# Altium project Power_Box_V1.PrjPcb
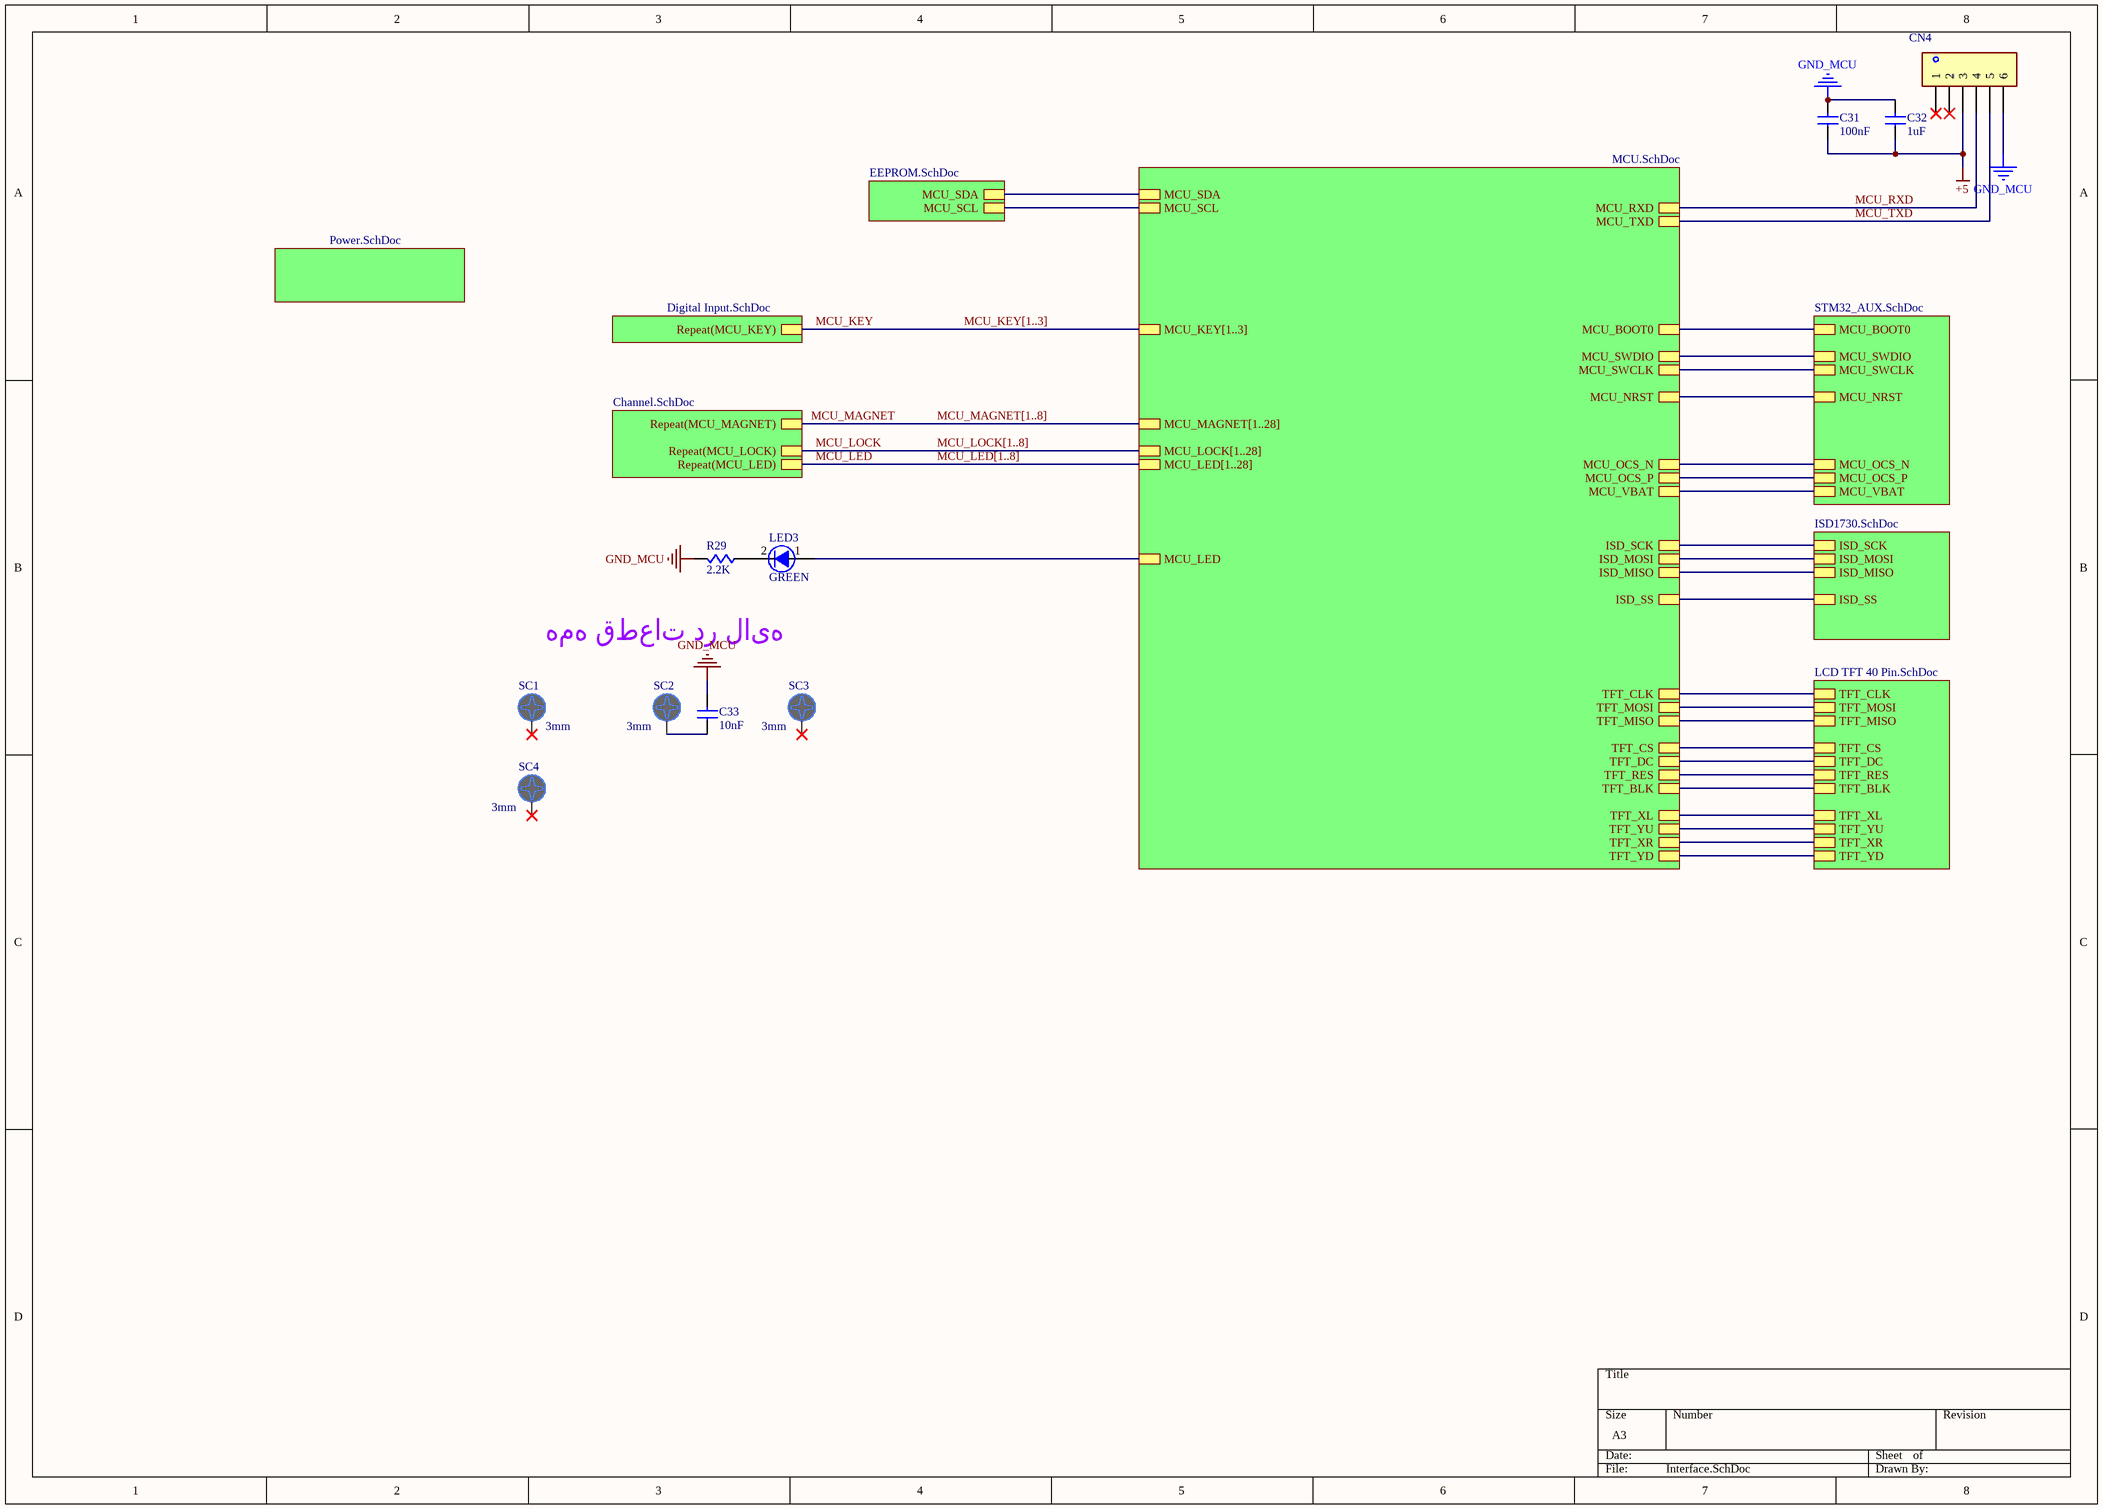
[diagram p0: Interface.SchDoc]
9 sheets, 207 parts. Net scope: hierarchical (ports join the sheet entries above them; power ports are global).
Board file: Power_Box_V1.PcbDoc
Sheets:
  Interface.SchDoc
    MCU = MCU.SchDoc
    STM_AUX = STM32_AUX.SchDoc
    TFT = LCD TFT 40 Pin.SchDoc
    ISD1730 = ISD1730.SchDoc
    EEPROM = EEPROM.SchDoc
    KEY1 = Digital Input.SchDoc
    KEY2 = Digital Input.SchDoc
    KEY3 = Digital Input.SchDoc
    Power = Power.SchDoc
    CHANNEL1 = Channel.SchDoc
    CHANNEL2 = Channel.SchDoc
    CHANNEL3 = Channel.SchDoc
    CHANNEL4 = Channel.SchDoc
    CHANNEL5 = Channel.SchDoc
    CHANNEL6 = Channel.SchDoc
    CHANNEL7 = Channel.SchDoc
    CHANNEL8 = Channel.SchDoc

## Sheet Interface.SchDoc
size A3; SheetNumber: 1; SheetTotal: 9

### Parts
C31  value 100nF  [C-0805]  (hidden comment: CAP Cer 100nF-50V-X7R-SMD)
C32  value 1uF  [C-0805]  (hidden comment: CAP Cer 1uF-50V-X7R-SMD)
C33  value 10nF  [CAP-CER-7x2.5-Ls5]  (hidden comment: CAP Cer 10nF-1KV-X7R-THD)
CN4  Connector XH-Straight-THD-2.54mm  [XH-6]  (value not drawn)
LED3  Color: GREEN  [LED-1206-Y]  (hidden comment: LED GREEN-1206-SMD)
R29  value 2.2K  [R-0805]  (hidden comment: RES 2.2K-5%-1/8W-SMD)
SC1  Size: 3mm  [Screw_M3]  (hidden comment: Screw 3mm)
SC2  Size: 3mm  [Screw_M3]  (hidden comment: Screw 3mm)
SC3  Size: 3mm  [Screw_M3]  (hidden comment: Screw 3mm)
SC4  Size: 3mm  [Screw_M3]  (hidden comment: Screw 3mm)

### Sub-sheets
EEPROM = EEPROM.SchDoc: MCU_SDA, MCU_SCL
ISD1730 = ISD1730.SchDoc: ISD_SCK, ISD_MOSI, ISD_MISO, ISD_SS
MCU = MCU.SchDoc: MCU_BOOT0, MCU_SWCLK, MCU_SWDIO, MCU_NRST, MCU_OCS_N, MCU_OCS_P, TFT_CS, TFT_CLK, TFT_DC, TFT_MOSI, TFT_MISO, TFT_RES, TFT_BLK, ISD_SCK, ISD_MOSI, ISD_MISO, ISD_SS, MCU_SDA, MCU_SCL, MCU_KEY[1..3], MCU_LOCK[1..28], MCU_LED[1..28], MCU_MAGNET[1..28], MCU_TXD, MCU_RXD, MCU_VBAT, TFT_XL, TFT_YU, TFT_XR, TFT_YD, MCU_LED
Power = Power.SchDoc: no entries
Repeat(CHANNEL, 1, 8) = Channel.SchDoc: Repeat(MCU_LOCK), Repeat(MCU_LED), Repeat(MCU_MAGNET)
Repeat(KEY, 1, 3) = Digital Input.SchDoc: Repeat(MCU_KEY)
STM_AUX = STM32_AUX.SchDoc: MCU_BOOT0, MCU_SWCLK, MCU_SWDIO, MCU_NRST, MCU_OCS_N, MCU_OCS_P, MCU_VBAT
TFT = LCD TFT 40 Pin.SchDoc: TFT_CS, TFT_CLK, TFT_DC, TFT_MOSI, TFT_MISO, TFT_RES, TFT_BLK, TFT_XL, TFT_YU, TFT_XR, TFT_YD

### Nets
+5: C31.1 C32.1 CN4.3
GND_MCU: C31.2 C32.2 C33.2 CN4.6 R29.2
ISD_MISO: sheet MCU/ISD_MISO, sheet ISD1730/ISD_MISO
ISD_MOSI: sheet MCU/ISD_MOSI, sheet ISD1730/ISD_MOSI
ISD_SCK: sheet MCU/ISD_SCK, sheet ISD1730/ISD_SCK
ISD_SS: sheet MCU/ISD_SS, sheet ISD1730/ISD_SS
MCU_BOOT0: sheet MCU/MCU_BOOT0, sheet STM_AUX/MCU_BOOT0
MCU_KEY: sheet Repeat(KEY, 1, 3)/Repeat(MCU_KEY)  [also labelled MCU_KEY[1..3]]
MCU_LED: sheet Repeat(CHANNEL, 1, 8)/Repeat(MCU_LED)
MCU_LOCK: sheet Repeat(CHANNEL, 1, 8)/Repeat(MCU_LOCK)
MCU_MAGNET: sheet Repeat(CHANNEL, 1, 8)/Repeat(MCU_MAGNET)
MCU_NRST: sheet MCU/MCU_NRST, sheet STM_AUX/MCU_NRST
MCU_OCS_N: sheet MCU/MCU_OCS_N, sheet STM_AUX/MCU_OCS_N
MCU_OCS_P: sheet MCU/MCU_OCS_P, sheet STM_AUX/MCU_OCS_P
MCU_RXD: CN4.4 ; sheet MCU/MCU_RXD
MCU_SCL: sheet MCU/MCU_SCL, sheet EEPROM/MCU_SCL
MCU_SDA: sheet MCU/MCU_SDA, sheet EEPROM/MCU_SDA
MCU_SWCLK: sheet MCU/MCU_SWCLK, sheet STM_AUX/MCU_SWCLK
MCU_SWDIO: sheet MCU/MCU_SWDIO, sheet STM_AUX/MCU_SWDIO
MCU_TXD: CN4.5 ; sheet MCU/MCU_TXD
MCU_VBAT: sheet MCU/MCU_VBAT, sheet STM_AUX/MCU_VBAT
TFT_BLK: sheet MCU/TFT_BLK, sheet TFT/TFT_BLK
TFT_CLK: sheet MCU/TFT_CLK, sheet TFT/TFT_CLK
TFT_CS: sheet MCU/TFT_CS, sheet TFT/TFT_CS
TFT_DC: sheet MCU/TFT_DC, sheet TFT/TFT_DC
TFT_MISO: sheet MCU/TFT_MISO, sheet TFT/TFT_MISO
TFT_MOSI: sheet MCU/TFT_MOSI, sheet TFT/TFT_MOSI
TFT_RES: sheet MCU/TFT_RES, sheet TFT/TFT_RES
TFT_XL: sheet MCU/TFT_XL, sheet TFT/TFT_XL
TFT_XR: sheet MCU/TFT_XR, sheet TFT/TFT_XR
TFT_YD: sheet MCU/TFT_YD, sheet TFT/TFT_YD
TFT_YU: sheet MCU/TFT_YU, sheet TFT/TFT_YU
NetC33_1: C33.1 SC2.1
NetLED3_1: LED3.1(A) ; sheet MCU/MCU_LED
NetLED3_2: LED3.2(C) R29.1

Not connected (* = marked no-connect by the designer): CN4 1* 2*; SC1 1*; SC3 1*; SC4 1*

### Buses and harness runs
bus MCU_LED[1..8] = sheet MCU/MCU_LED[1..28]
bus MCU_LOCK[1..8] = sheet MCU/MCU_LOCK[1..28]
bus MCU_MAGNET[1..8] = sheet MCU/MCU_MAGNET[1..28]

### Notes on the sheet
- همه قطعات در لایه بالا قرار بگیرند

### Library data of the parts
C31 C32 = CAP-CER: CAPACITOR; Phone Number: 0915 8700 314; Voltage: 50V; Tolerance: X7R; Type: SMD; Publisher: Mahdi Bagherzadeh; ComponentLink1Description: Linkedin; ComponentLink1URL: https://ir.linkedin.com/in/mahdi-bagherzade; Published Date: 9-15-2024
C33 = CAP-CER: CAPACITOR; Phone Number: 0915 8700 314; Voltage: 1KV; Tolerance: X7R; Type: THD; Publisher: Mahdi Bagherzadeh; ComponentLink1Description: Linkedin; ComponentLink1URL: https://ir.linkedin.com/in/mahdi-bagherzade; Published Date: 9-15-2024
CN4 = CN-6pin: CONNECTOR; Phone Number: 0915 8700 314; Value: XH; Publisher: Mahdi Bagherzadeh; ComponentLink1Description: Linkedin; ComponentLink1URL: https://ir.linkedin.com/in/mahdi-bagherzade; Published Date: 9-15-2024; Size: 2.54mm; Type: Straight-THD
LED3 = LED: Phone Number: 0915 8700 314; Type: SMD; Publisher: Mahdi Bagherzadeh; ComponentLink1Description: Linkedin; ComponentLink1URL: https://ir.linkedin.com/in/mahdi-bagherzade; Published Date: 9-15-2024; Size: 1206
R29 = RES: RESISTOR; Phone Number: 0915 8700 314; Tolerance: 5%; Power: 1/8W; Publisher: Mahdi Bagherzadeh; ComponentLink1Description: Linkedin; ComponentLink1URL: https://ir.linkedin.com/in/mahdi-bagherzade; Published Date: 9-15-2024; Type: SMD
SC1-SC4 = SCREW: Phone Number: 0915 8700 314; Publisher: Mahdi Bagherzadeh; ComponentLink1Description: Linkedin; ComponentLink1URL: https://ir.linkedin.com/in/mahdi-bagherzade; Published Date: 9-15-2024

## Sheet MCU.SchDoc
size A4; SheetNumber: 7; SheetTotal: 9
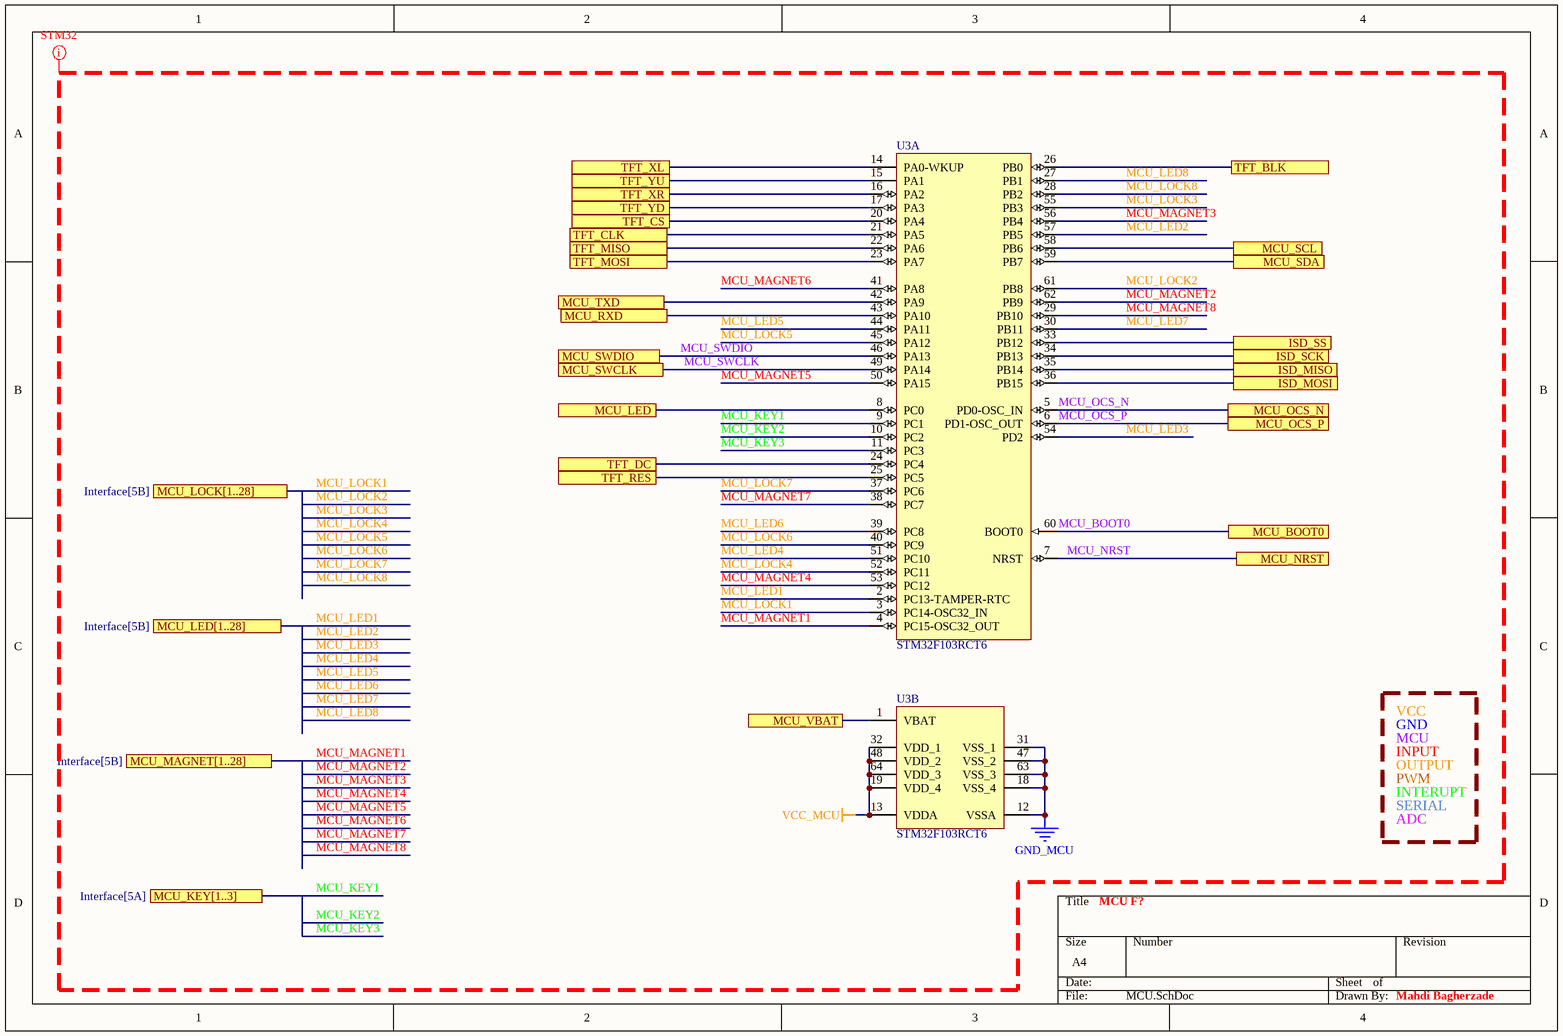
[diagram p1: MCU.SchDoc]

### Parts
U3  STM32F103RCT6  [STM-LQFP64_N]  (parts A,B of 2)

### Ports
ISD_MISO (see Interface[7B], ISD1730[1B]), ISD_MOSI (see Interface[7B], ISD1730[1B]), ISD_SCK (see Interface[7B], ISD1730[1B]), ISD_SS (see Interface[7B], ISD1730[1B]), MCU_BOOT0 (see Interface[7A], STM32_AUX[2B]), MCU_KEY[1..3] (see Interface[5A]), MCU_LED (see Interface[5B]), MCU_LED[1..28] (see Interface[5B]), MCU_LOCK[1..28] (see Interface[5B]), MCU_MAGNET[1..28] (see Interface[5B]), MCU_NRST (see Interface[7B], STM32_AUX[3A]), MCU_OCS_N (see Interface[7B], STM32_AUX[4A]), MCU_OCS_P (see Interface[7B], STM32_AUX[4A]), MCU_RXD (see Interface[7A]), MCU_SCL (see Interface[5A], EEPROM[3B]), MCU_SDA (see Interface[5A], EEPROM[3B]), MCU_SWCLK (see Interface[7A], STM32_AUX[2B]), MCU_SWDIO (see Interface[7A], STM32_AUX[2B]), MCU_TXD (see Interface[7A]), MCU_VBAT (see Interface[7B], STM32_AUX[1D]), TFT_BLK (see Interface[7C], LCD TFT 40 Pin[1B]), TFT_CLK (see Interface[7B], LCD TFT 40 Pin[1A]), TFT_CS (see Interface[7B], LCD TFT 40 Pin[1A]), TFT_DC (see Interface[7C], LCD TFT 40 Pin[1A]), TFT_MISO (see Interface[7B], LCD TFT 40 Pin[1A]), TFT_MOSI (see Interface[7B], LCD TFT 40 Pin[1A]), TFT_RES (see Interface[7C], LCD TFT 40 Pin[1B]), TFT_XL (see Interface[7C], LCD TFT 40 Pin[1B]), TFT_XR (see Interface[7C], LCD TFT 40 Pin[1B]), TFT_YD (see Interface[7C], LCD TFT 40 Pin[1B]), TFT_YU (see Interface[7C], LCD TFT 40 Pin[1B])

### Nets
GND_MCU: U3.12(VSSA) U3.18(VSS_4) U3.31(VSS_1) U3.47(VSS_2) U3.63(VSS_3)
VCC_MCU: U3.13(VDDA) U3.19(VDD_4) U3.32(VDD_1) U3.48(VDD_2) U3.64(VDD_3)
ISD_MISO: U3.35(PB14) ; port ISD_MISO
ISD_MOSI: U3.36(PB15) ; port ISD_MOSI
ISD_SCK: U3.34(PB13) ; port ISD_SCK
ISD_SS: U3.33(PB12) ; port ISD_SS
MCU_BOOT0: U3.60(BOOT0) ; port MCU_BOOT0
MCU_KEY1: U3.9(PC1)
MCU_KEY2: U3.10(PC2)
MCU_KEY3: U3.11(PC3)
MCU_LED1: U3.2(PC13-TAMPER-RTC)
MCU_LED2: U3.57(PB5)
MCU_LED3: U3.54(PD2)
MCU_LED4: U3.51(PC10)
MCU_LED5: U3.44(PA11)
MCU_LED6: U3.39(PC8)
MCU_LED7: U3.30(PB11)
MCU_LED8: U3.27(PB1)
MCU_LOCK1: U3.3(PC14-OSC32_IN)
MCU_LOCK2: U3.61(PB8)
MCU_LOCK3: U3.55(PB3)
MCU_LOCK4: U3.52(PC11)
MCU_LOCK5: U3.45(PA12)
MCU_LOCK6: U3.40(PC9)
MCU_LOCK7: U3.37(PC6)
MCU_LOCK8: U3.28(PB2)
MCU_MAGNET1: U3.4(PC15-OSC32_OUT)
MCU_MAGNET2: U3.62(PB9)
MCU_MAGNET3: U3.56(PB4)
MCU_MAGNET4: U3.53(PC12)
MCU_MAGNET5: U3.50(PA15)
MCU_MAGNET6: U3.41(PA8)
MCU_MAGNET7: U3.38(PC7)
MCU_MAGNET8: U3.29(PB10)
MCU_NRST: U3.7(NRST) ; port MCU_NRST
MCU_OCS_N: U3.5(PD0-OSC_IN) ; port MCU_OCS_N
MCU_OCS_P: U3.6(PD1-OSC_OUT) ; port MCU_OCS_P
MCU_RXD: U3.43(PA10) ; port MCU_RXD
MCU_SCL: U3.58(PB6) ; port MCU_SCL
MCU_SDA: U3.59(PB7) ; port MCU_SDA
MCU_SWCLK: U3.49(PA14) ; port MCU_SWCLK
MCU_SWDIO: U3.46(PA13) ; port MCU_SWDIO
MCU_TXD: U3.42(PA9) ; port MCU_TXD
MCU_VBAT: U3.1(VBAT) ; port MCU_VBAT
TFT_BLK: U3.26(PB0) ; port TFT_BLK
TFT_CLK: U3.21(PA5) ; port TFT_CLK
TFT_CS: U3.20(PA4) ; port TFT_CS
TFT_DC: U3.24(PC4) ; port TFT_DC
TFT_MISO: U3.22(PA6) ; port TFT_MISO
TFT_MOSI: U3.23(PA7) ; port TFT_MOSI
TFT_RES: U3.25(PC5) ; port TFT_RES
TFT_XL: U3.14(PA0-WKUP) ; port TFT_XL
TFT_XR: U3.16(PA2) ; port TFT_XR
TFT_YD: U3.17(PA3) ; port TFT_YD
TFT_YU: U3.15(PA1) ; port TFT_YU
NetLED3_1: U3.8(PC0) ; port MCU_LED

### Layout directives
net class STM32: GND_MCU, MCU_BOOT0, MCU_KEY1, MCU_KEY2, MCU_KEY3, MCU_LED1, MCU_LED2, MCU_LED3, MCU_LED4, MCU_LED5, MCU_LED6, MCU_LED7, MCU_LED8, MCU_LOCK1, MCU_LOCK2, MCU_LOCK3, MCU_LOCK4, MCU_LOCK5, MCU_LOCK6, MCU_LOCK7, MCU_LOCK8, MCU_MAGNET1, MCU_MAGNET2, MCU_MAGNET3, MCU_MAGNET4, MCU_MAGNET5, MCU_MAGNET6, MCU_MAGNET7, MCU_MAGNET8, MCU_NRST, MCU_OCS_N, MCU_OCS_P, MCU_SWCLK, MCU_SWDIO, VCC_MCU

### Notes on the sheet
- VCC
- INPUT
- OUTPUT
- PWM
- MCU
- GND
- INTERUPT
- SERIAL
- ADC
- MCU F?
- Mahdi Bagherzade

### Library data of the parts
U3 = STM32F103RCT6: ARM Cortex-M3 32-bit MCU, 256 KB Flash, 48 KB Internal RAM, 51 I/Os, 64-pin LQFP, -40 to 85 degC, Tray; A/D Converter: 3x12-bit (16 Channel); D/A Converter: 2x12-bit (2 Channel); FLASH Size (Prog) (kB): 256; I/Os (High Current): 51; Internal RAM Size (kB): 48; Operating Frequency(F) (Processor speed) (MHz): 72; Supply Voltage(Vcc) min (V): 2; DatasheetVersion: Rev. 8; PackageVersion: Rev. 4, 06/2013; PackageReference: LQFP64; PackageDescription: 64-Pin Low Profile Quad Flat Package, 10 x 10 mm Body, 0.5 mm Pitch; Supplier 1: Digi-Key; Supplier Part Number 1: 497-9033-ND; Supplier 2: Newark; Supplier Part Number 2: 01P4099; Supplier 3: Newark; Supplier Part Number 3: 57P1227; Supplier 4: Mouser; Supplier Part Number 4: 511-STM32F103RCT6; Core: ARM Cortex-M3; Packing: Tray; Mounting Technology: Surface Mount; PartNumber: STM32F103RCT6; ComponentLink1Description: Manufacturer URL; ComponentLink1URL: http://www.st.com/web/en/home.html; ComponentLink2Description: Datasheet; ComponentLink2URL: http://www.st.com/st-web-ui/static/active/en/resource/technical/document/datasheet/CD00191185.pdf; ComponentLink3Description: Package Specification; ComponentLink3URL: http://www.st.com/st-web-ui/static/active/en/resource/technical/document/datasheet/DM00037051.pdf

## Sheet STM32_AUX.SchDoc
size A4; SheetNumber: 8; SheetTotal: 9
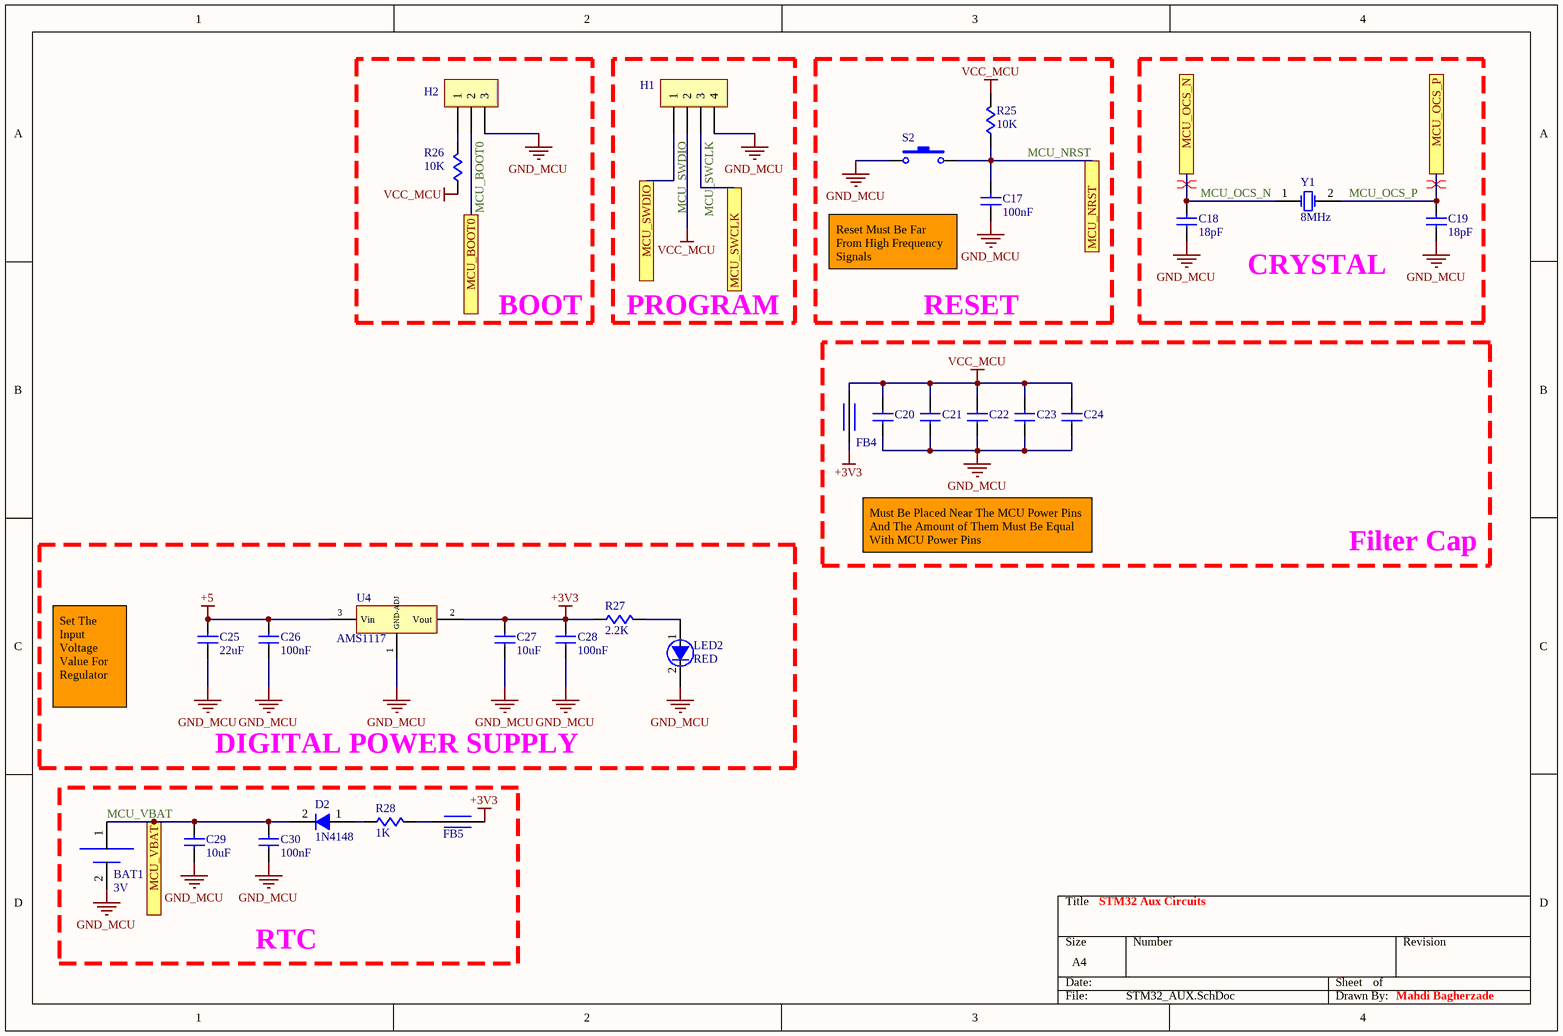
[diagram p2: STM32_AUX.SchDoc]

### Parts
BAT1  Voltage: 3V  [BAT-HOLDER-SMD-1220]  (hidden comment: Bat Holder 2016-SMD)
C17  value 100nF  [C-0805]  (hidden comment: CAP Cer 100nF-50V-X7R-SMD)
C18  value 18pF  [C-0805]  (hidden comment: CAP Cer 18pF-50V-X7R-SMD)
C19  value 18pF  [C-0805]  (hidden comment: CAP Cer 18pF-50V-X7R-SMD)
C20  CAP Cer 100nF-50V-X7R-SMD  [C-0805]  (value not drawn)
C21  CAP Cer 100nF-50V-X7R-SMD  [C-0805]  (value not drawn)
C22  CAP Cer 100nF-50V-X7R-SMD  [C-0805]  (value not drawn)
C23  CAP Cer 100nF-50V-X7R-SMD  [C-0805]  (value not drawn)
C24  CAP Cer 100nF-50V-X7R-SMD  [C-0805]  (value not drawn)
C25  value 22uF  [C-0805]  (hidden comment: CAP Cer 22uF-50V-X7R-SMD)
C26  value 100nF  [C-0805]  (hidden comment: CAP Cer 100nF-50V-X7R-SMD)
C27  value 10uF  [C-0805]  (hidden comment: CAP Cer 10uF-50V-X7R-SMD)
C28  value 100nF  [C-0805]  (hidden comment: CAP Cer 100nF-50V-X7R-SMD)
C29  value 10uF  [C-0805]  (hidden comment: CAP Cer 10uF-50V-X7R-SMD)
C30  value 100nF  [C-0805]  (hidden comment: CAP Cer 100nF-50V-X7R-SMD)
D2  Code: 1N4148  [SOD80]  (hidden comment: Diode 1N4148-SMD)
FB4  FERRITE BEAD  [FB-0805]  (value not drawn)
FB5  Ferrite Bead SMD  [FB-0805]  (value not drawn)
H1  Header 4x1 Pin -Straight-Male-2.54mm  [H-4pin-M-S]  (value not drawn)
H2  Header 3x1 Pin -Straight-Male-2.54mm  [H-3pin-M-S]  (value not drawn)
LED2  Color: RED  [LED-1206-R]  (hidden comment: LED RED-1206-SMD)
R25  value 10K  [R-0805]  (hidden comment: RES 10K-5%-1/8W-SMD)
R26  value 10K  [R-0805]  (hidden comment: RES 10K-5%-1/8W-SMD)
R27  value 2.2K  [R-0805]  (hidden comment: RES 2.2K-5%-1/8W-SMD)
R28  value 1K  [R-0805]  (hidden comment: RES 1K-5%-1/8W-SMD)
S2  Push Button 3x6mm-2Pin-SMD  [SW-SMD-2pin-3x6]  (value not drawn)
U4  Reg AMS1117-3.3V-SMD  [SOT223]  (value not drawn)
Y1  value 8MHz  [CRYSTAL-SMD]  (hidden comment: Crystal 8MHz-SMD)

### Blocks framed on the sheet
BOOT: H2 R26
PROGRAM: H1
RESET: C17 R25 S2
CRYSTAL: C18 C19 Y1
Filter Cap: C20-C24 FB4
DIGITAL POWER SUPPLY: C25-C28 LED2 R27 U4
RTC: BAT1 C29 C30 D2 FB5 R28

### Ports
MCU_BOOT0 (see Interface[7A], MCU[4C]), MCU_NRST (see Interface[7B], MCU[4C]), MCU_OCS_N (see Interface[7B], MCU[4B]), MCU_OCS_P (see Interface[7B], MCU[4B]), MCU_SWCLK (see Interface[7A], MCU[2B]), MCU_SWDIO (see Interface[7A], MCU[2B]), MCU_VBAT (see Interface[7B], MCU[2C])

### Nets
+3V3: C27.2 C28.2 FB4.1 FB5.1 R27.1 U4.2(Vout)
+5: C25.2 C26.2 U4.3(Vin)
GND_MCU: BAT1.2(-) C17.1 C18.1 C19.1 C20.2 C21.2 C22.2 C23.2 C24.2 C25.1 C26.1 C27.1 C28.1 C29.1 C30.1 H1.4 H2.3 LED2.2(C) S2.1 U4.1(GND-ADJ)
VCC_MCU: C20.1 C21.1 C22.1 C23.1 C24.1 FB4.2 H1.2 R25.2 R26.1
MCU_BOOT0: H2.2 ; port MCU_BOOT0
MCU_NRST: C17.2 R25.1 S2.2 ; port MCU_NRST
MCU_OCS_N: C18.2 Y1.1(OSC1) ; port MCU_OCS_N
MCU_OCS_P: C19.2 Y1.2(OSC2) ; port MCU_OCS_P
MCU_SWCLK: H1.3 ; port MCU_SWCLK
MCU_SWDIO: H1.1 ; port MCU_SWDIO
MCU_VBAT: BAT1.1(+) C29.2 C30.2 D2.2(C) ; port MCU_VBAT
NetD2_1: D2.1(A) R28.1
NetFB5_2: FB5.2 R28.2
NetH2_1: H2.1 R26.2
NetLED2_1: LED2.1(A) R27.2

### Layout directives
differential pair: MCU_OCS_N, MCU_OCS_P

### Notes on the sheet
- Reset Must Be Far From High Frequency Signals
- Must Be Placed Near The MCU Power Pins And The Amount of Them Must Be Equal With MCU Power Pins
- Set The Input Voltage Value For Regulator
- STM32 Aux Circuits
- Mahdi Bagherzade

### Library data of the parts
BAT1 = BATTERY HOLDER: BATTERY; Phone Number: 0915 8700 314; Publisher: Mahdi Bagherzadeh; ComponentLink1Description: Linkedin; ComponentLink1URL: https://ir.linkedin.com/in/mahdi-bagherzade; Published Date: 9-15-2024; Size: 2016; Type: SMD
C17-C19 C25-C30 = CAP-CER: as C31 on sheet Interface; Publisher: Mahdi Bagherzadeh; ComponentLink1Description: Linkedin; ComponentLink1URL: https://ir.linkedin.com/in/mahdi-bagherzade; Published Date: 9-15-2024
C20-C24 = CAP-CER: CAPACITOR; Phone Number: 0915 8700 314; Voltage: 50V; Tolerance: X7R; Type: SMD; Value: 100nF; Publisher: Mahdi Bagherzadeh; ComponentLink1Description: Linkedin; ComponentLink1URL: https://ir.linkedin.com/in/mahdi-bagherzade; Published Date: 9-15-2024
D2 = DIODE: Phone Number: 0915 8700 314; Type: SMD; Publisher: Mahdi Bagherzadeh; ComponentLink1Description: Linkedin; ComponentLink1URL: https://ir.linkedin.com/in/mahdi-bagherzade; Published Date: 9-15-2024
FB4 FB5 = FERRITE BEAD: INDUCATOR; Phone Number: 0915 8700 314; Publisher: Mahdi Bagherzadeh; ComponentLink1Description: Linkedin; ComponentLink1URL: https://ir.linkedin.com/in/mahdi-bagherzade; Published Date: 9-15-2024
  FB5: Type: SMD
H1 = HEADER-4pin: HEADER; Phone Number: 0915 8700 314; Publisher: Mahdi Bagherzadeh; ComponentLink1Description: Linkedin; ComponentLink1URL: https://ir.linkedin.com/in/mahdi-bagherzade; Published Date: 9-15-2024; Type: Straight-Male; Size: 2.54mm
H2 = HEADER-3pin: HEADER; Phone Number: 0915 8700 314; Publisher: Mahdi Bagherzadeh; ComponentLink1Description: Linkedin; ComponentLink1URL: https://ir.linkedin.com/in/mahdi-bagherzade; Published Date: 9-15-2024; Type: Straight-Male; Size: 2.54mm
LED2 = LED: Phone Number: 0915 8700 314; Type: SMD; Publisher: Mahdi Bagherzadeh; ComponentLink1Description: Linkedin; ComponentLink1URL: https://ir.linkedin.com/in/mahdi-bagherzade; Published Date: 9-15-2024; Size: 1206
R25-R28 = RES: as R29 on sheet Interface; Publisher: Mahdi Bagherzadeh; ComponentLink1Description: Linkedin; ComponentLink1URL: https://ir.linkedin.com/in/mahdi-bagherzade; Published Date: 9-15-2024; Type: SMD
S2 = PUSH BUTTON: SWITCH; Phone Number: 0915 8700 314; Publisher: Mahdi Bagherzadeh; ComponentLink1Description: Linkedin; ComponentLink1URL: https://ir.linkedin.com/in/mahdi-bagherzade; Published Date: 9-15-2024; Size: 3x6mm; Type: 2Pin-SMD
U4 = AMS1117: REGULATOR; Phone Number: 0915 8700 314; Voltage: 3.3V; Publisher: Mahdi Bagherzadeh; ComponentLink1Description: Linkedin; ComponentLink1URL: https://ir.linkedin.com/in/mahdi-bagherzade; Published Date: 9-15-2024; Type: SMD; Code: AMS1117
Y1 = CRYSTAL: Phone Number: 0915 8700 314; Publisher: Mahdi Bagherzadeh; ComponentLink1Description: Linkedin; ComponentLink1URL: https://ir.linkedin.com/in/mahdi-bagherzade; Published Date: 9-15-2024; Type: SMD

## Sheet LCD TFT 40 Pin.SchDoc
size A; SheetNumber: 6; SheetTotal: 9
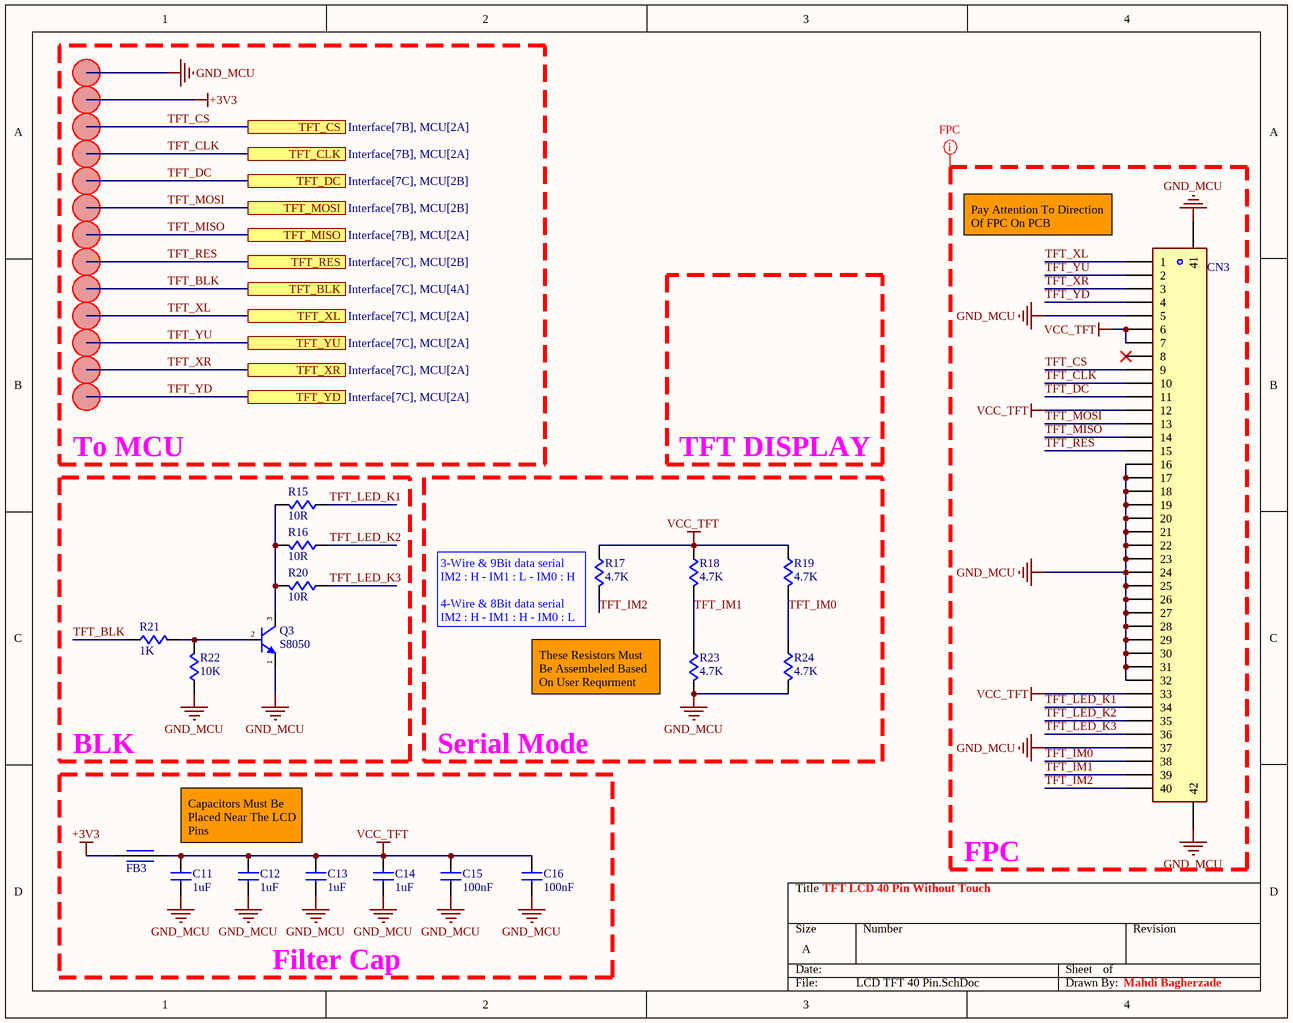
[diagram p3: LCD TFT 40 Pin.SchDoc]

### Parts
C11  value 1uF  [C-0805]  (hidden comment: CAP Cer 1uF-50V-X7R-SMD)
C12  value 1uF  [C-0805]  (hidden comment: CAP Cer 1uF-50V-X7R-SMD)
C13  value 1uF  [C-0805]  (hidden comment: CAP Cer 1uF-50V-X7R-SMD)
C14  value 1uF  [C-0805]  (hidden comment: CAP Cer 1uF-50V-X7R-SMD)
C15  value 100nF  [C-0805]  (hidden comment: CAP Cer 100nF-50V-X7R-SMD)
C16  value 100nF  [C-0805]  (hidden comment: CAP Cer 100nF-50V-X7R-SMD)
CN3  Connector FPC Right-2mm-40 Pin  [CN-FPC-40-0.5mm-hor]  (value not drawn)
FB3  Ferrite Bead SMD  [FB-0805]  (value not drawn)
Q3  value S8050  [SOT23-213]  (hidden comment: TR S8050-SMD)
R15  value 10R  [R-0805]  (hidden comment: RES 10R-5%-1/8W-SMD)
R16  value 10R  [R-0805]  (hidden comment: RES 10R-5%-1/8W-SMD)
R17  value 4.7K  [R-0805]  (hidden comment: RES 4.7K-5%-1/8W-SMD)
R18  value 4.7K  [R-0805]  (hidden comment: RES 4.7K-5%-1/8W-SMD)
R19  value 4.7K  [R-0805]  (hidden comment: RES 4.7K-5%-1/8W-SMD)
R20  value 10R  [R-0805]  (hidden comment: RES 10R-5%-1/8W-SMD)
R21  value 1K  [R-0805]  (hidden comment: RES 1K-5%-1/8W-SMD)
R22  value 10K  [R-0805]  (hidden comment: RES 10K-5%-1/8W-SMD)
R23  value 4.7K  [R-0805]  (hidden comment: RES 4.7K-5%-1/8W-SMD)
R24  value 4.7K  [R-0805]  (hidden comment: RES 4.7K-5%-1/8W-SMD)
TP1  (no value)  [TEST POINT-DIP]  (net tie, no BOM)
TP2  (no value)  [TEST POINT-DIP]  (net tie, no BOM)
TP3  (no value)  [TEST POINT-DIP]  (net tie, no BOM)
TP4  (no value)  [TEST POINT-DIP]  (net tie, no BOM)
TP5  (no value)  [TEST POINT-DIP]  (net tie, no BOM)
TP6  (no value)  [TEST POINT-DIP]  (net tie, no BOM)
TP7  (no value)  [TEST POINT-DIP]  (net tie, no BOM)
TP8  (no value)  [TEST POINT-DIP]  (net tie, no BOM)
TP9  (no value)  [TEST POINT-DIP]  (net tie, no BOM)
TP10  (no value)  [TEST POINT-DIP]  (net tie, no BOM)
TP11  (no value)  [TEST POINT-DIP]  (net tie, no BOM)
TP12  (no value)  [TEST POINT-DIP]  (net tie, no BOM)
TP13  (no value)  [TEST POINT-DIP]  (net tie, no BOM)

### Blocks framed on the sheet
To MCU: TP1-TP13

### Ports
TFT_BLK (see Interface[7C], MCU[4A]), TFT_CLK (see Interface[7B], MCU[2A]), TFT_CS (see Interface[7B], MCU[2A]), TFT_DC (see Interface[7C], MCU[2B]), TFT_MISO (see Interface[7B], MCU[2A]), TFT_MOSI (see Interface[7B], MCU[2B]), TFT_RES (see Interface[7C], MCU[2B]), TFT_XL (see Interface[7C], MCU[2A]), TFT_XR (see Interface[7C], MCU[2A]), TFT_YD (see Interface[7C], MCU[2A]), TFT_YU (see Interface[7C], MCU[2A])

### Nets
+3V3: FB3.1 TP2.1(TP)
GND_MCU: C11.1 C12.1 C13.1 C14.1 C15.1 C16.1 CN3.5 CN3.16 CN3.17 CN3.18 CN3.19 CN3.20 CN3.21 CN3.22 CN3.23 CN3.24 CN3.25 CN3.26 CN3.27 CN3.28 CN3.29 CN3.30 CN3.31 CN3.32 CN3.37 CN3.41 CN3.42 Q3.1(E) R22.1 R23.2 R24.2 TP1.1(TP)
VCC_TFT: C11.2 C12.2 C13.2 C14.2 C15.2 C16.2 CN3.6 CN3.7 CN3.12 CN3.33 FB3.2 R17.1 R18.1 R19.1
TFT_BLK: R21.1 TP9.1(TP) ; port TFT_BLK
TFT_CLK: CN3.10 TP4.1(TP) ; port TFT_CLK
TFT_CS: CN3.9 TP3.1(TP) ; port TFT_CS
TFT_DC: CN3.11 TP5.1(TP) ; port TFT_DC
TFT_IM0: CN3.38 R19.2 R24.1
TFT_IM1: CN3.39 R18.2 R23.1
TFT_IM2: CN3.40 R17.2
TFT_LED_K1: CN3.34 R15.1
TFT_LED_K2: CN3.35 R16.1
TFT_LED_K3: CN3.36 R20.1
TFT_MISO: CN3.14 TP7.1(TP) ; port TFT_MISO
TFT_MOSI: CN3.13 TP6.1(TP) ; port TFT_MOSI
TFT_RES: CN3.15 TP8.1(TP) ; port TFT_RES
TFT_XL: CN3.1 TP10.1(TP) ; port TFT_XL
TFT_XR: CN3.3 TP12.1(TP) ; port TFT_XR
TFT_YD: CN3.4 TP13.1(TP) ; port TFT_YD
TFT_YU: CN3.2 TP11.1(TP) ; port TFT_YU
NetQ3_2: Q3.2(B) R21.2 R22.2
NetQ3_3: Q3.3(C) R15.2 R16.2 R20.2

Not connected (* = marked no-connect by the designer): CN3 8*

### Layout directives
net class FPC: GND_MCU, TFT_CLK, TFT_CS, TFT_DC, TFT_IM0, TFT_IM1, TFT_IM2, TFT_LED_K1, TFT_LED_K2, TFT_LED_K3, TFT_MISO, TFT_MOSI, TFT_RES, TFT_XL, TFT_XR, TFT_YD, TFT_YU, VCC_TFT

### Notes on the sheet
- (near CN3) Pay Attention To Direction Of FPC On PCB
- TFT DISPLAY
- (near R17) 3-Wire & 9Bit data serial
  IM2 : H - IM1 : L - IM0 : H
  4-Wire & 8Bit data serial
  IM2 : H - IM1 : H - IM0 : L
- These Resistors Must Be Assembeled Based On User Requrment
- BLK
- Serial Mode
- Capacitors Must Be Placed Near The LCD Pins
- TFT LCD 40 Pin Without Touch
- FPC
- Filter Cap
- Mahdi Bagherzade

### Library data of the parts
C11-C16 = CAP-CER: as C31 on sheet Interface; Publisher: Mahdi Bagherzadeh; ComponentLink1Description: Linkedin; ComponentLink1URL: https://ir.linkedin.com/in/mahdi-bagherzade; Published Date: 9-15-2024
CN3 = CN-FPC-40pin: CONNECTOR; Phone Number: 0915 8700 314; Publisher: Mahdi Bagherzadeh; ComponentLink1Description: Linkedin; ComponentLink1URL: https://ir.linkedin.com/in/mahdi-bagherzade; Published Date: 9-15-2024; Size: 2mm-40 Pin; Type: Right
FB3 = FERRITE BEAD: INDUCATOR; Phone Number: 0915 8700 314; Publisher: Mahdi Bagherzadeh; ComponentLink1Description: Linkedin; ComponentLink1URL: https://ir.linkedin.com/in/mahdi-bagherzade; Published Date: 9-15-2024; Type: SMD
Q3 = S8050: TRANSISTOR; Phone Number: 0915 8700 314; Code: J3Y; Type: SMD; Publisher: Mahdi Bagherzadeh; ComponentLink1Description: Linkedin; ComponentLink1URL: https://ir.linkedin.com/in/mahdi-bagherzade; Published Date: 9-15-2024
R15-R24 = RES: RESISTOR; Phone Number: 0915 8700 314; Power: 1/8W; Tolerance: 5%; Publisher: Mahdi Bagherzadeh; ComponentLink1Description: Linkedin; ComponentLink1URL: https://ir.linkedin.com/in/mahdi-bagherzade; Published Date: 9-15-2024; Type: SMD
TP1-TP13 = TEST PIONT: Phone Number: 0915 8700 314; Publisher: Mahdi Bagherzadeh; ComponentLink1Description: Linkedin; ComponentLink1URL: https://ir.linkedin.com/in/mahdi-bagherzade; Published Date: 9-15-2024

## Sheet ISD1730.SchDoc
size A; SheetNumber: 5; SheetTotal: 9
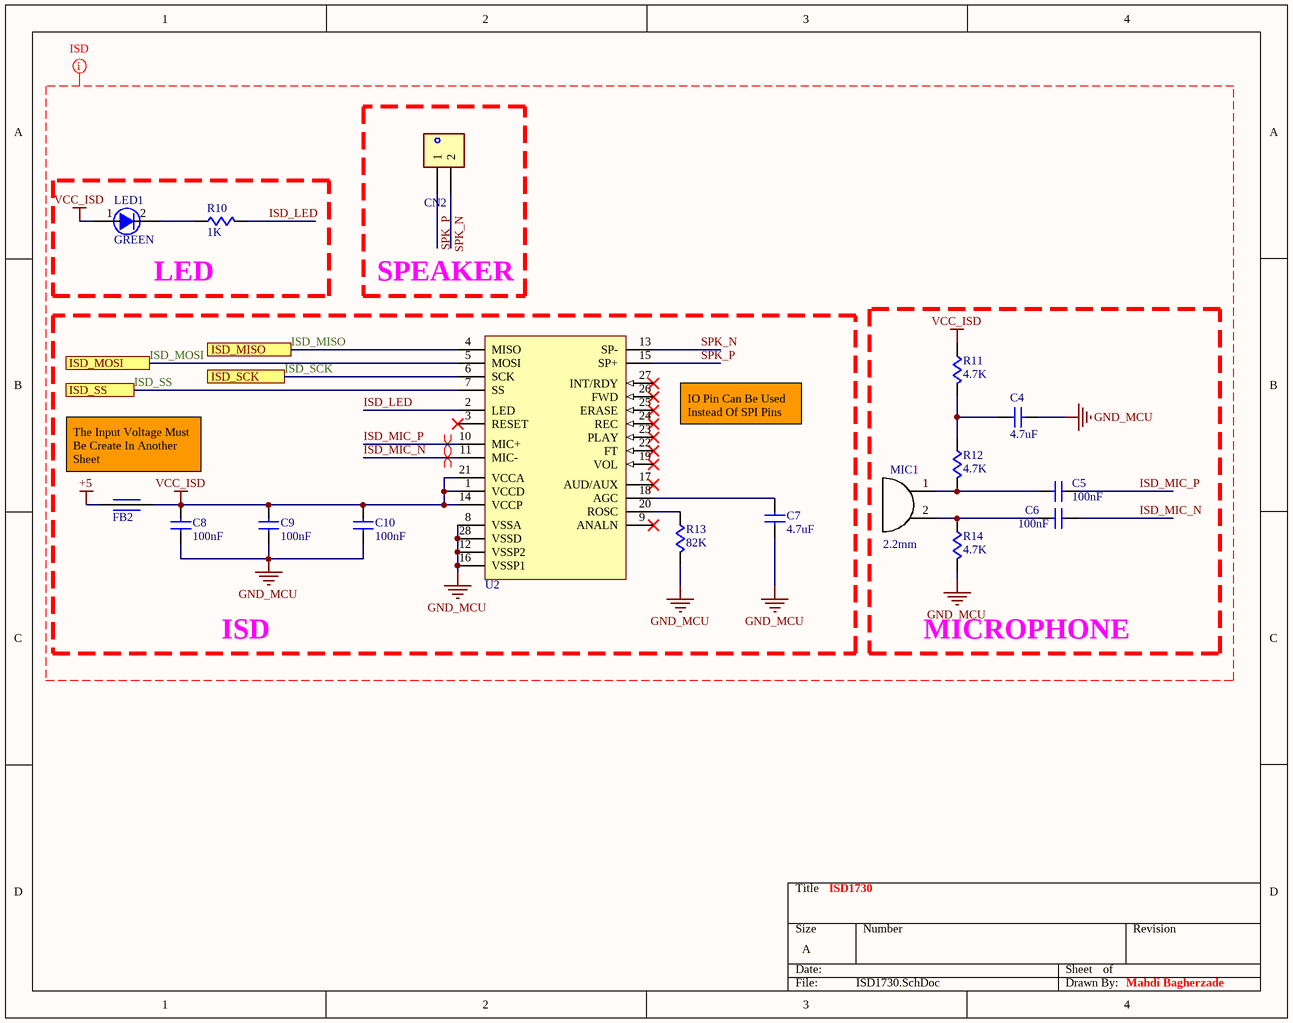
[diagram p4: ISD1730.SchDoc]

### Parts
C4  value 4.7uF  [C-0805]  (hidden comment: CAP Cer 4.7uF-50V-X7R-SMD)
C5  value 100nF  [C-0805]  (hidden comment: CAP Cer 100nF-50V-X7R-SMD)
C6  value 100nF  [C-0805]  (hidden comment: CAP Cer 100nF-50V-X7R-SMD)
C7  value 4.7uF  [C-0805]  (hidden comment: CAP Cer 4.7uF-50V-X7R-SMD)
C8  value 100nF  [C-0805]  (hidden comment: CAP Cer 100nF-50V-X7R-SMD)
C9  value 100nF  [C-0805]  (hidden comment: CAP Cer 100nF-50V-X7R-SMD)
C10  value 100nF  [C-0805]  (hidden comment: CAP Cer 100nF-50V-X7R-SMD)
CN2  Connector XH-2-Straight-THD-2.54mm  [XH-2]  (value not drawn)
FB2  Ferrite Bead SMD  [FB-0805]  (value not drawn)
LED1  Color: GREEN  [LED-1206-Y]  (hidden comment: LED GREEN-1206-SMD)
MIC1  Size: 2.2mm  [MIC-2.2mm]  (hidden comment: Mic 2.2mm-THD)
R10  value 1K  [R-0805]  (hidden comment: RES 1K-5%-1/8W-SMD)
R11  value 4.7K  [R-0805]  (hidden comment: RES 4.7K-5%-1/8W-SMD)
R12  value 4.7K  [R-0805]  (hidden comment: RES 4.7K-5%-1/8W-SMD)
R13  value 82K  [R-0805]  (hidden comment: RES 82K-5%-1/8W-SMD)
R14  value 4.7K  [R-0805]  (hidden comment: RES 4.7K-5%-1/8W-SMD)
U2  IC ISD1730-SMD  [DIP28-wide]  (value not drawn)

### Blocks framed on the sheet
SPEAKER: CN2
LED: LED1 R10
ISD: C7-C10 FB2 R13 U2
MICROPHONE: C4-C6 MIC1 R11 R12 R14

### Ports
ISD_MISO (see Interface[7B], MCU[4B]), ISD_MOSI (see Interface[7B], MCU[4B]), ISD_SCK (see Interface[7B], MCU[4B]), ISD_SS (see Interface[7B], MCU[4B])

### Nets
+5: FB2.1
GND_MCU: C4.2 C7.2 C8.2 C9.2 C10.2 R13.2 R14.2 U2.8(VSSA) U2.12(VSSP2) U2.16(VSSP1) U2.28(VSSD)
VCC_ISD: C8.1 C9.1 C10.1 FB2.2 LED1.1(A) R11.1 U2.1(VCCD) U2.14(VCCP) U2.21(VCCA)
ISD_LED: R10.2 U2.2(LED)
ISD_MIC_N: C6.2 U2.11(MIC-)
ISD_MIC_P: C5.2 U2.10(MIC+)
ISD_MISO: U2.4(MISO) ; port ISD_MISO
ISD_MOSI: U2.5(MOSI) ; port ISD_MOSI
ISD_SCK: U2.6(SCK) ; port ISD_SCK
ISD_SS: U2.7(SS) ; port ISD_SS
SPK_N: CN2.2 U2.13(SP-)
SPK_P: CN2.1 U2.15(SP+)
NetC4_1: C4.1 R11.2 R12.1
NetC5_1: C5.1 MIC1.1 R12.2
NetC6_1: C6.1 MIC1.2 R14.1
NetC7_1: C7.1 U2.18(AGC)
NetLED1_2: LED1.2(C) R10.1
NetR13_1: R13.1 U2.20(ROSC)

Not connected (* = marked no-connect by the designer): U2 3(RESET)* 9(ANALN)* 17(AUD/AUX)* 19(VOL)* 22(FT)* 23(PLAY)* 24(REC)* 25(ERASE)* 26(FWD)* 27(INT/RDY)*

### Layout directives
differential pair: ISD_MIC_N, ISD_MIC_P
net class ISD: +5, GND_MCU, ISD_LED, ISD_MIC_N, ISD_MIC_P, ISD_MISO, ISD_MOSI, ISD_SCK, ISD_SS, SPK_N, SPK_P, VCC_ISD

### Notes on the sheet
- IO Pin Can Be Used Instead Of SPI Pins
- The Input Voltage Must Be Create In Another Sheet
- ISD1730
- Mahdi Bagherzade

### Library data of the parts
C4-C10 = CAP-CER: as C31 on sheet Interface; Publisher: Mahdi Bagherzadeh; ComponentLink1Description: Linkedin; ComponentLink1URL: https://ir.linkedin.com/in/mahdi-bagherzade; Published Date: 9-15-2024
CN2 = CN-2pin: CONNECTOR; Phone Number: 0915 8700 314; Value: XH-2; Publisher: Mahdi Bagherzadeh; ComponentLink1Description: Linkedin; ComponentLink1URL: https://ir.linkedin.com/in/mahdi-bagherzade; Published Date: 9-15-2024; Size: 2.54mm; Type: Straight-THD
FB2 = FERRITE BEAD: INDUCATOR; Phone Number: 0915 8700 314; Publisher: Mahdi Bagherzadeh; ComponentLink1Description: Linkedin; ComponentLink1URL: https://ir.linkedin.com/in/mahdi-bagherzade; Published Date: 9-15-2024; Type: SMD
LED1 = LED: Phone Number: 0915 8700 314; Type: SMD; Publisher: Mahdi Bagherzadeh; ComponentLink1Description: Linkedin; ComponentLink1URL: https://ir.linkedin.com/in/mahdi-bagherzade; Published Date: 9-15-2024; Size: 1206
MIC1 = MIC: Phone Number: 0915 8700 314; Publisher: Mahdi Bagherzadeh; ComponentLink1Description: Linkedin; ComponentLink1URL: https://ir.linkedin.com/in/mahdi-bagherzade; Published Date: 9-15-2024; Type: THD
R10-R14 = RES: as R15 on sheet LCD TFT 40 Pin; Publisher: Mahdi Bagherzadeh; ComponentLink1Description: Linkedin; ComponentLink1URL: https://ir.linkedin.com/in/mahdi-bagherzade; Published Date: 9-15-2024; Type: SMD
U2 = ISD1730: IC; Phone Number: 0915 8700 314; Publisher: Mahdi Bagherzadeh; ComponentLink1Description: Linkedin; ComponentLink1URL: https://ir.linkedin.com/in/mahdi-bagherzade; Published Date: 9-15-2024; Code: ISD1730; Type: SMD

## Sheet EEPROM.SchDoc
size A; SheetNumber: 4; SheetTotal: 9
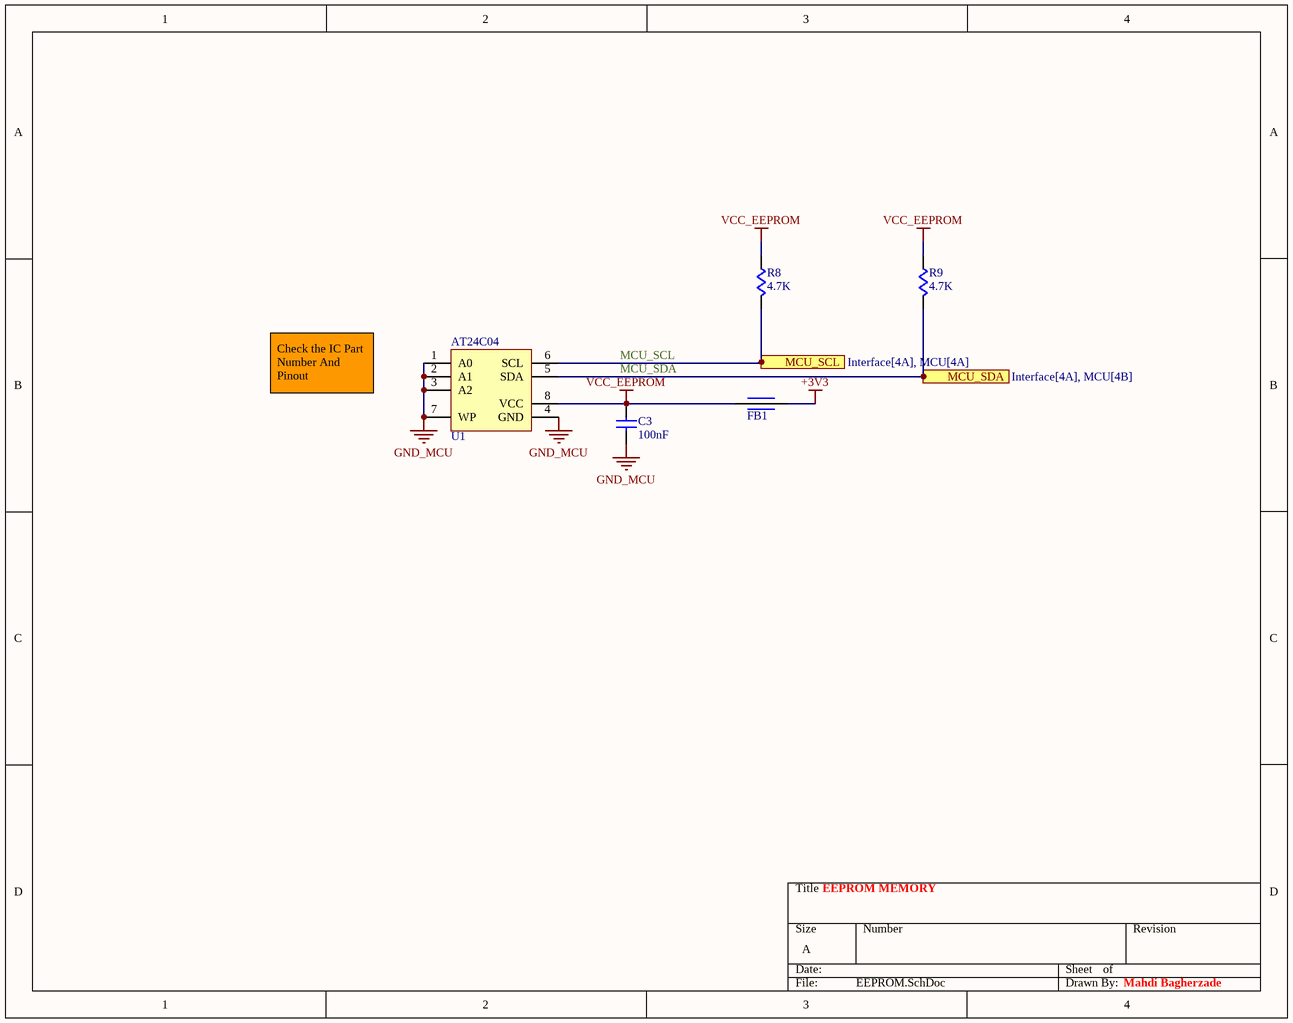
[diagram p5: EEPROM.SchDoc]

### Parts
C3  value 100nF  [C-0805]  (hidden comment: CAP Cer 100nF-50V-X7R-SMD)
FB1  Ferrite Bead SMD  [FB-0805]  (value not drawn)
R8  value 4.7K  [R-0805]  (hidden comment: RES 4.7K-5%-1/8W-SMD)
R9  value 4.7K  [R-0805]  (hidden comment: RES 4.7K-5%-1/8W-SMD)
U1  IC AT24C04-SMD  [SOIC8]  (value not drawn)

### Ports
MCU_SCL (see Interface[4A], MCU[4A]), MCU_SDA (see Interface[4A], MCU[4B])

### Nets
+3V3: FB1.2
GND_MCU: C3.2 U1.1(A0) U1.2(A1) U1.3(A2) U1.4(GND) U1.7(WP)
VCC_EEPROM: C3.1 FB1.1 R8.1 R9.1 U1.8(VCC)
MCU_SCL: R8.2 U1.6(SCL) ; port MCU_SCL
MCU_SDA: R9.2 U1.5(SDA) ; port MCU_SDA

### Notes on the sheet
- Check the IC Part Number And Pinout
- EEPROM MEMORY
- Mahdi Bagherzade

### Library data of the parts
C3 = CAP-CER: as C31 on sheet Interface; Publisher: Mahdi Bagherzadeh; ComponentLink1Description: Linkedin; ComponentLink1URL: https://ir.linkedin.com/in/mahdi-bagherzade; Published Date: 9-15-2024
FB1 = FERRITE BEAD: INDUCATOR; Phone Number: 0915 8700 314; Publisher: Mahdi Bagherzadeh; ComponentLink1Description: Linkedin; ComponentLink1URL: https://ir.linkedin.com/in/mahdi-bagherzade; Published Date: 9-15-2024; Type: SMD
R8 R9 = RES: as R15 on sheet LCD TFT 40 Pin; Publisher: Mahdi Bagherzadeh; ComponentLink1Description: Linkedin; ComponentLink1URL: https://ir.linkedin.com/in/mahdi-bagherzade; Published Date: 9-15-2024; Type: SMD
U1 = AT24C04: IC; Phone Number: 0915 8700 314; Publisher: Mahdi Bagherzadeh; ComponentLink1Description: Linkedin; ComponentLink1URL: https://ir.linkedin.com/in/mahdi-bagherzade; Published Date: 9-15-2024; Code: AT24C04; Type: SMD

## Sheet Digital Input.SchDoc
size A; SheetNumber: 2; SheetTotal: 9
Used 3 times, as channels KEY1, KEY2, KEY3. Parts and nets are listed once, with the designators drawn on the sheet.
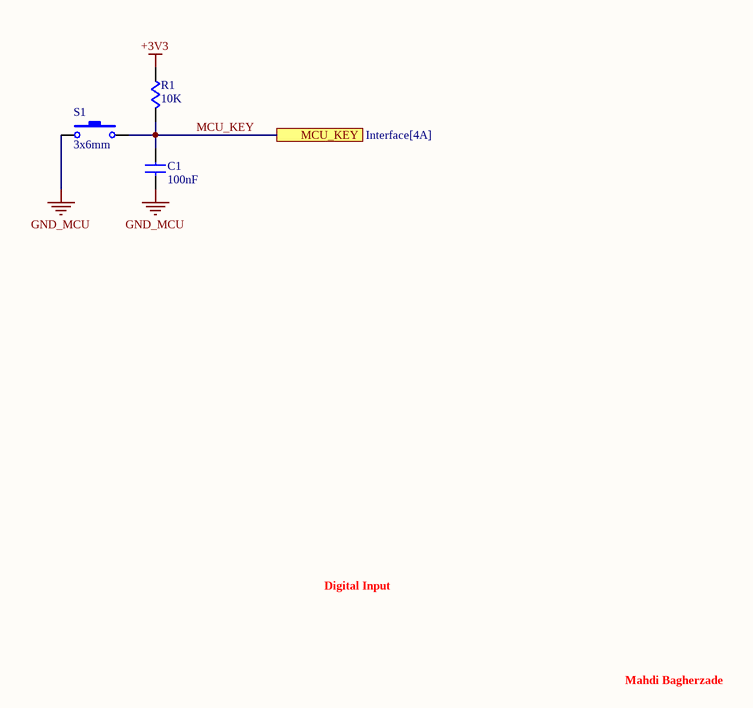
[diagram p6: Digital Input.SchDoc]

### Parts
C1  value 100nF  [C-0805]  (hidden comment: CAP Cer 100nF-50V-X7R-SMD)
R1  value 10K  [R-0805]  (hidden comment: RES 10K-5%-1/8W-SMD)
S1  Size: 3x6mm  [SW-SMD-2pin-3x6]  (hidden comment: Push Button 3x6mm-2Pin-SMD)

### Ports
MCU_KEY (see Interface[4A])

### Nets
+3V3: R1.1
GND_MCU: C1.2 S1.1
MCU_KEY: C1.1 R1.2 S1.2 ; port MCU_KEY

### Channels
KEY1: designators end in A; ports MCU_KEY=MCU_KEY_KEY1
KEY2: designators end in B; ports MCU_KEY=MCU_KEY_KEY2
KEY3: designators end in C; ports MCU_KEY=MCU_KEY_KEY3

### Notes on the sheet
- Digital Input
- Mahdi Bagherzade

### Library data of the parts
C1 = CAP-CER: as C31 on sheet Interface; Publisher: Mahdi Bagherzadeh; ComponentLink1Description: Linkedin; ComponentLink1URL: https://ir.linkedin.com/in/mahdi-bagherzade; Published Date: 9-15-2024
R1 = RES: as R29 on sheet Interface; Publisher: Mahdi Bagherzadeh; ComponentLink1Description: Linkedin; ComponentLink1URL: https://ir.linkedin.com/in/mahdi-bagherzade; Published Date: 9-15-2024; Type: SMD
S1 = PUSH BUTTON: SWITCH; Phone Number: 0915 8700 314; Publisher: Mahdi Bagherzadeh; ComponentLink1Description: Linkedin; ComponentLink1URL: https://ir.linkedin.com/in/mahdi-bagherzade; Published Date: 9-15-2024; Type: 2Pin-SMD

## Sheet Power.SchDoc
size A4; SheetNumber: 9; SheetTotal: 9
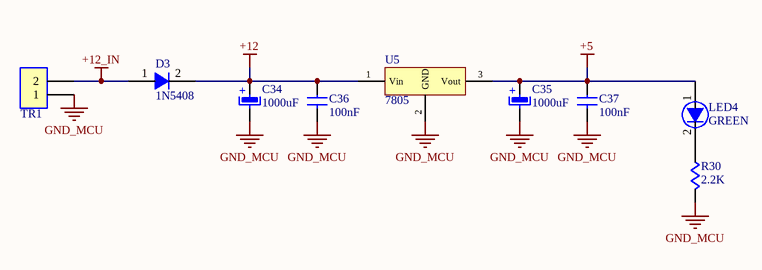
[diagram p7: Power.SchDoc]

### Parts
C34  value 1000uF  [CAP-Elec-10x25-5]  (hidden comment: CAP Elec 1000uF-25V-10x25-THD)
C35  value 1000uF  [CAP-Elec-6.3x12]  (hidden comment: CAP Elec 1000uF-10V-10x25-THD)
C36  value 100nF  [C-0805]  (hidden comment: CAP Cer 100nF-50V-X7R-SMD)
C37  value 100nF  [C-0805]  (hidden comment: CAP Cer 100nF-50V-X7R-SMD)
D3  Code: 1N5408  [D-DO214]  (hidden comment: Diode 1N5408-SMD)
LED4  Color: GREEN  [LED-1206-Y]  (hidden comment: LED GREEN-1206-SMD)
R30  value 2.2K  [R-0805]  (hidden comment: RES 2.2K-5%-1/8W-SMD)
TR1  Terminal KF301-2Pin-5.08mm-Straight  [KF301-2pin]  (value not drawn)
U5  Code: 7805  [TO220-HEARSINK-1]  (hidden comment: Reg 7805-5V-THD)

### Nets
+5: C35.1 C37.1 LED4.1(A) U5.3(Vout)
+12: C34.1 C36.1 D3.2(C) U5.1(Vin)
+12_IN: D3.1(A) TR1.2
GND_MCU: C34.2 C35.2 C36.2 C37.2 R30.2 TR1.1 U5.2(GND)
NetLED4_2: LED4.2(C) R30.1

### Notes on the sheet
- (in symbol CAP-ELEC) +

### Library data of the parts
C34 = CAP-ELEC: CAPACITOR; Phone Number: 0915 8700 314; Voltage: 25V; Type: THD; Publisher: Mahdi Bagherzadeh; ComponentLink1Description: Linkedin; ComponentLink1URL: https://ir.linkedin.com/in/mahdi-bagherzade; Published Date: 9-15-2024; Size: 10x25
C35 = CAP-ELEC: CAPACITOR; Phone Number: 0915 8700 314; Voltage: 10V; Type: THD; Publisher: Mahdi Bagherzadeh; ComponentLink1Description: Linkedin; ComponentLink1URL: https://ir.linkedin.com/in/mahdi-bagherzade; Published Date: 9-15-2024; Size: 10x25
C36 C37 = CAP-CER: as C31 on sheet Interface; Publisher: Mahdi Bagherzadeh; ComponentLink1Description: Linkedin; ComponentLink1URL: https://ir.linkedin.com/in/mahdi-bagherzade; Published Date: 9-15-2024
D3 = DIODE: Phone Number: 0915 8700 314; Type: SMD; Publisher: Mahdi Bagherzadeh; ComponentLink1Description: Linkedin; ComponentLink1URL: https://ir.linkedin.com/in/mahdi-bagherzade; Published Date: 9-15-2024
LED4 = LED: Phone Number: 0915 8700 314; Type: SMD; Publisher: Mahdi Bagherzadeh; ComponentLink1Description: Linkedin; ComponentLink1URL: https://ir.linkedin.com/in/mahdi-bagherzade; Published Date: 9-15-2024; Size: 1206
R30 = RES: as R29 on sheet Interface; Publisher: Mahdi Bagherzadeh; ComponentLink1Description: Linkedin; ComponentLink1URL: https://ir.linkedin.com/in/mahdi-bagherzade; Published Date: 9-15-2024; Type: SMD
TR1 = TEMINAL-2pin: TERMINAL; Phone Number: 0915 8700 314; Publisher: Mahdi Bagherzadeh; ComponentLink1Description: Linkedin; ComponentLink1URL: https://ir.linkedin.com/in/mahdi-bagherzade; Published Date: 9-15-2024; Size: 5.08mm; Code: KF301-2Pin; Type: Straight
U5 = 78Mxx: REGULATOR; Phone Number: 0915 8700 314; Voltage: 5V; Publisher: Mahdi Bagherzadeh; ComponentLink1Description: Linkedin; ComponentLink1URL: https://ir.linkedin.com/in/mahdi-bagherzade; Published Date: 9-15-2024; Type: THD

## Sheet Channel.SchDoc
size A; SheetNumber: 3; SheetTotal: 9
Used 8 times, as channels CHANNEL1, CHANNEL2, CHANNEL3, CHANNEL4, CHANNEL5, CHANNEL6, CHANNEL7, CHANNEL8. Parts and nets are listed once, with the designators drawn on the sheet.
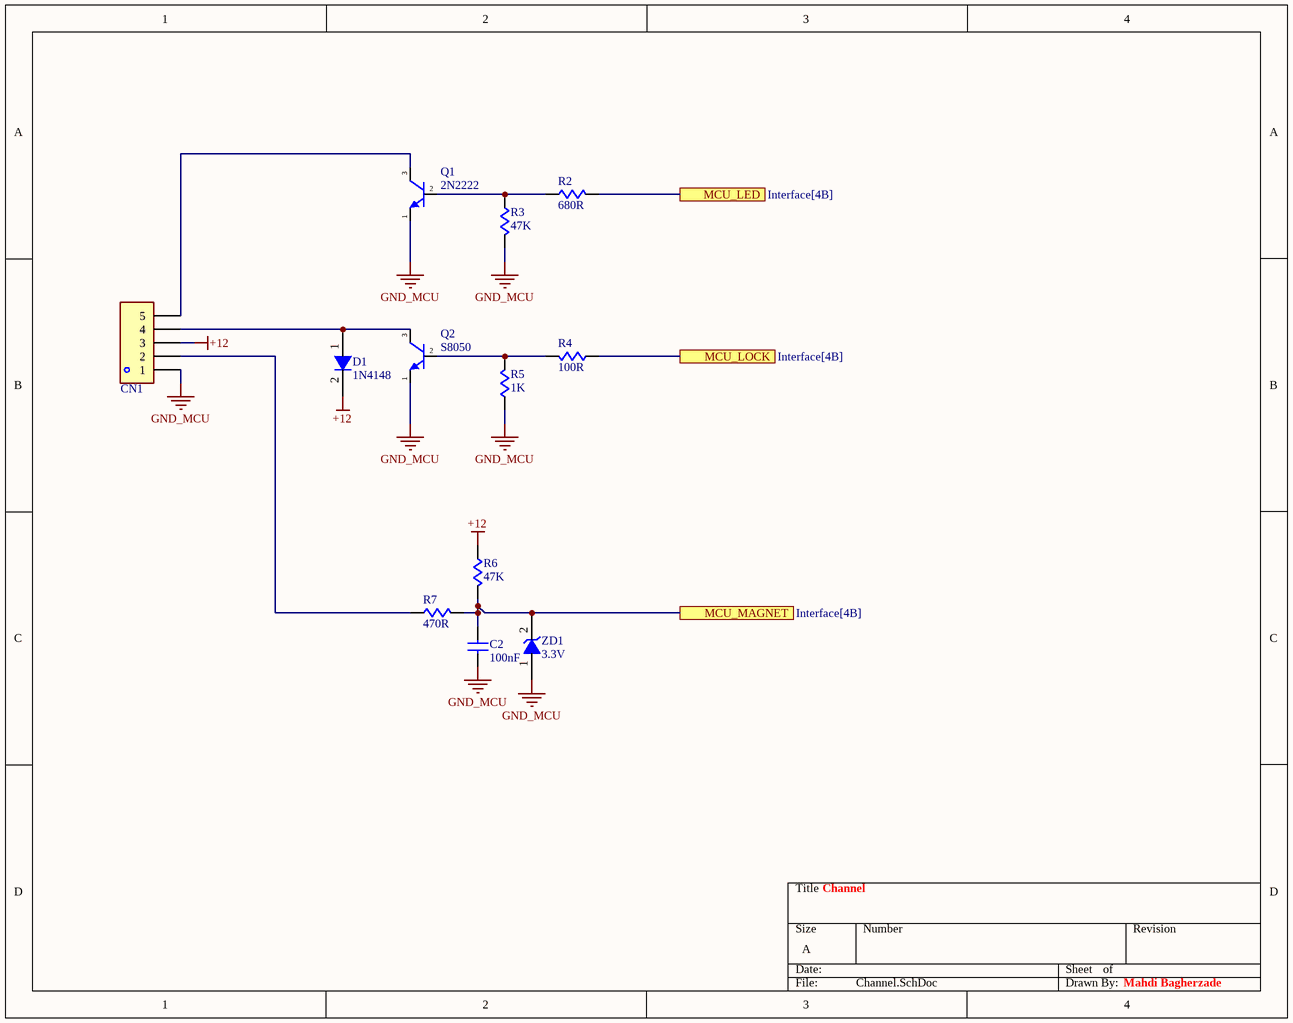
[diagram p8: Channel.SchDoc]

### Parts
C2  value 100nF  [C-0805]  (hidden comment: CAP Cer 100nF-50V-X7R-SMD)
CN1  Connector XH-Straight-THD-2.54mm  [XH-5]  (value not drawn)
D1  Code: 1N4148  [SOD80]  (hidden comment: Diode 1N4148-SMD)
Q1  value 2N2222  [SOT23-213]  (hidden comment: TR 2N2222-SMD)
Q2  value S8050  [SOT23-213]  (hidden comment: TR S8050-SMD)
R2  value 680R  [R-0805]  (hidden comment: RES 680R-5%-1/8W-SMD)
R3  value 47K  [R-0805]  (hidden comment: RES 47K-5%-1/8W-SMD)
R4  value 100R  [R-0805]  (hidden comment: RES 100R-5%-1/8W-SMD)
R5  value 1K  [R-0805]  (hidden comment: RES 1K-5%-1/8W-SMD)
R6  value 47K  [R-0805]  (hidden comment: RES 47K-5%-1/8W-SMD)
R7  value 470R  [R-0805]  (hidden comment: RES 470R-5%-1/8W-SMD)
ZD1  Voltage: 3.3V  [SOD80]  (hidden comment: Zener -3.3V-SMD)

### Ports
MCU_LED (see Interface[4B]), MCU_LOCK (see Interface[4B]), MCU_MAGNET (see Interface[4B])

### Nets
+12: CN1.3 D1.2(C) R6.1
GND_MCU: C2.2 CN1.1 Q1.1(E) Q2.1(E) R3.2 R5.1 ZD1.1(A)
MCU_LED: R2.2 ; port MCU_LED
MCU_LOCK: R4.1 ; port MCU_LOCK
MCU_MAGNET: C2.1 R6.2 R7.2 ZD1.2(C) ; port MCU_MAGNET
NetCN1_2: CN1.2 R7.1
NetCN1_4: CN1.4 D1.1(A) Q2.3(C)
NetCN1_5: CN1.5 Q1.3(C)
NetQ1_2: Q1.2(B) R2.1 R3.1
NetQ2_2: Q2.2(B) R4.2 R5.2

### Channels
CHANNEL1: designators end in A; ports MCU_LED=MCU_LED1 MCU_LOCK=MCU_LOCK1 MCU_MAGNET=MCU_MAGNET1
CHANNEL2: designators end in B; ports MCU_LED=MCU_LED2 MCU_LOCK=MCU_LOCK2 MCU_MAGNET=MCU_MAGNET2
CHANNEL3: designators end in C; ports MCU_LED=MCU_LED3 MCU_LOCK=MCU_LOCK3 MCU_MAGNET=MCU_MAGNET3
CHANNEL4: designators end in D; ports MCU_LED=MCU_LED4 MCU_LOCK=MCU_LOCK4 MCU_MAGNET=MCU_MAGNET4
CHANNEL5: designators end in E; ports MCU_LED=MCU_LED5 MCU_LOCK=MCU_LOCK5 MCU_MAGNET=MCU_MAGNET5
CHANNEL6: designators end in F; ports MCU_LED=MCU_LED6 MCU_LOCK=MCU_LOCK6 MCU_MAGNET=MCU_MAGNET6
CHANNEL7: designators end in G; ports MCU_LED=MCU_LED7 MCU_LOCK=MCU_LOCK7 MCU_MAGNET=MCU_MAGNET7
CHANNEL8: designators end in H; ports MCU_LED=MCU_LED8 MCU_LOCK=MCU_LOCK8 MCU_MAGNET=MCU_MAGNET8

### Notes on the sheet
- Channel
- Mahdi Bagherzade

### Library data of the parts
C2 = CAP-CER: as C31 on sheet Interface; Publisher: Mahdi Bagherzadeh; ComponentLink1Description: Linkedin; ComponentLink1URL: https://ir.linkedin.com/in/mahdi-bagherzade; Published Date: 9-15-2024
CN1 = CN-5pin: CONNECTOR; Phone Number: 0915 8700 314; Value: XH; Publisher: Mahdi Bagherzadeh; ComponentLink1Description: Linkedin; ComponentLink1URL: https://ir.linkedin.com/in/mahdi-bagherzade; Published Date: 9-15-2024; Type: Straight-THD; Size: 2.54mm
D1 = DIODE: Phone Number: 0915 8700 314; Type: SMD; Publisher: Mahdi Bagherzadeh; ComponentLink1Description: Linkedin; ComponentLink1URL: https://ir.linkedin.com/in/mahdi-bagherzade; Published Date: 9-15-2024
Q1 = 2N2222: TRANSISTOR; Phone Number: 0915 8700 314; Type: SMD; Code: 1P; Publisher: Mahdi Bagherzadeh; ComponentLink1Description: Linkedin; ComponentLink1URL: https://ir.linkedin.com/in/mahdi-bagherzade; Published Date: 9-15-2024
Q2 = S8050: as Q3 on sheet LCD TFT 40 Pin; Publisher: Mahdi Bagherzadeh; ComponentLink1Description: Linkedin; ComponentLink1URL: https://ir.linkedin.com/in/mahdi-bagherzade; Published Date: 9-15-2024
R2-R7 = RES: as R29 on sheet Interface; Publisher: Mahdi Bagherzadeh; ComponentLink1Description: Linkedin; ComponentLink1URL: https://ir.linkedin.com/in/mahdi-bagherzade; Published Date: 9-15-2024; Type: SMD
ZD1 = DIODE-ZENER: DIODE; Phone Number: 0915 8700 314; Power: Minimelf; Publisher: Mahdi Bagherzadeh; ComponentLink1Description: Linkedin; ComponentLink1URL: https://ir.linkedin.com/in/mahdi-bagherzade; Published Date: 9-15-2024; Type: SMD

## Nets that join several sheets
+3V3: STM32_AUX (6 pins), LCD TFT 40 Pin (FB3.1 TP2.1), EEPROM (FB1.2), KEY1 (R1A.1), KEY2 (R1B.1), KEY3 (R1C.1)
+5: Interface (C31.1 C32.1 CN4.3), STM32_AUX (C25.2 C26.2 U4.3), ISD1730 (FB2.1), Power (C35.1 C37.1 LED4.1 U5.3)
+12: Power (C34.1 C36.1 D3.2 U5.1), CHANNEL1 (CN1A.3 D1A.2 R6A.1), CHANNEL2 (CN1B.3 D1B.2 R6B.1), CHANNEL3 (CN1C.3 D1C.2 R6C.1), CHANNEL4 (CN1D.3 D1D.2 R6D.1), CHANNEL5 (CN1E.3 D1E.2 R6E.1), CHANNEL6 (CN1F.3 D1F.2 R6F.1), CHANNEL7 (CN1G.3 D1G.2 R6G.1), CHANNEL8 (CN1H.3 D1H.2 R6H.1)
GND_MCU: Interface (5 pins), MCU (5 pins), STM32_AUX (20 pins), LCD TFT 40 Pin (32 pins), ISD1730 (11 pins), EEPROM (6 pins), KEY1 (C1A.2 S1A.1), KEY2 (C1B.2 S1B.1), KEY3 (C1C.2 S1C.1), Power (7 pins), CHANNEL1 (7 pins), CHANNEL2 (7 pins), CHANNEL3 (7 pins), CHANNEL4 (7 pins), CHANNEL5 (7 pins), CHANNEL6 (7 pins), CHANNEL7 (7 pins), CHANNEL8 (7 pins)
VCC_MCU: MCU (5 pins), STM32_AUX (9 pins)
ISD_MISO: MCU (U3.35), ISD1730 (U2.4)
ISD_MOSI: MCU (U3.36), ISD1730 (U2.5)
ISD_SCK: MCU (U3.34), ISD1730 (U2.6)
ISD_SS: MCU (U3.33), ISD1730 (U2.7)
MCU_BOOT0: MCU (U3.60), STM32_AUX (H2.2)
MCU_NRST: MCU (U3.7), STM32_AUX (C17.2 R25.1 S2.2)
MCU_OCS_N: MCU (U3.5), STM32_AUX (C18.2 Y1.1)
MCU_OCS_P: MCU (U3.6), STM32_AUX (C19.2 Y1.2)
MCU_RXD: Interface (CN4.4), MCU (U3.43)
MCU_SCL: MCU (U3.58), EEPROM (R8.2 U1.6)
MCU_SDA: MCU (U3.59), EEPROM (R9.2 U1.5)
MCU_SWCLK: MCU (U3.49), STM32_AUX (H1.3)
MCU_SWDIO: MCU (U3.46), STM32_AUX (H1.1)
MCU_TXD: Interface (CN4.5), MCU (U3.42)
MCU_VBAT: MCU (U3.1), STM32_AUX (BAT1.1 C29.2 C30.2 D2.2)
NetLED3_1: Interface (LED3.1), MCU (U3.8)
TFT_BLK: MCU (U3.26), LCD TFT 40 Pin (R21.1 TP9.1)
TFT_CLK: MCU (U3.21), LCD TFT 40 Pin (CN3.10 TP4.1)
TFT_CS: MCU (U3.20), LCD TFT 40 Pin (CN3.9 TP3.1)
TFT_DC: MCU (U3.24), LCD TFT 40 Pin (CN3.11 TP5.1)
TFT_MISO: MCU (U3.22), LCD TFT 40 Pin (CN3.14 TP7.1)
TFT_MOSI: MCU (U3.23), LCD TFT 40 Pin (CN3.13 TP6.1)
TFT_RES: MCU (U3.25), LCD TFT 40 Pin (CN3.15 TP8.1)
TFT_XL: MCU (U3.14), LCD TFT 40 Pin (CN3.1 TP10.1)
TFT_XR: MCU (U3.16), LCD TFT 40 Pin (CN3.3 TP12.1)
TFT_YD: MCU (U3.17), LCD TFT 40 Pin (CN3.4 TP13.1)
TFT_YU: MCU (U3.15), LCD TFT 40 Pin (CN3.2 TP11.1)